# EAGLE design stm32f4_adapter (EAGLE 6.5.0)
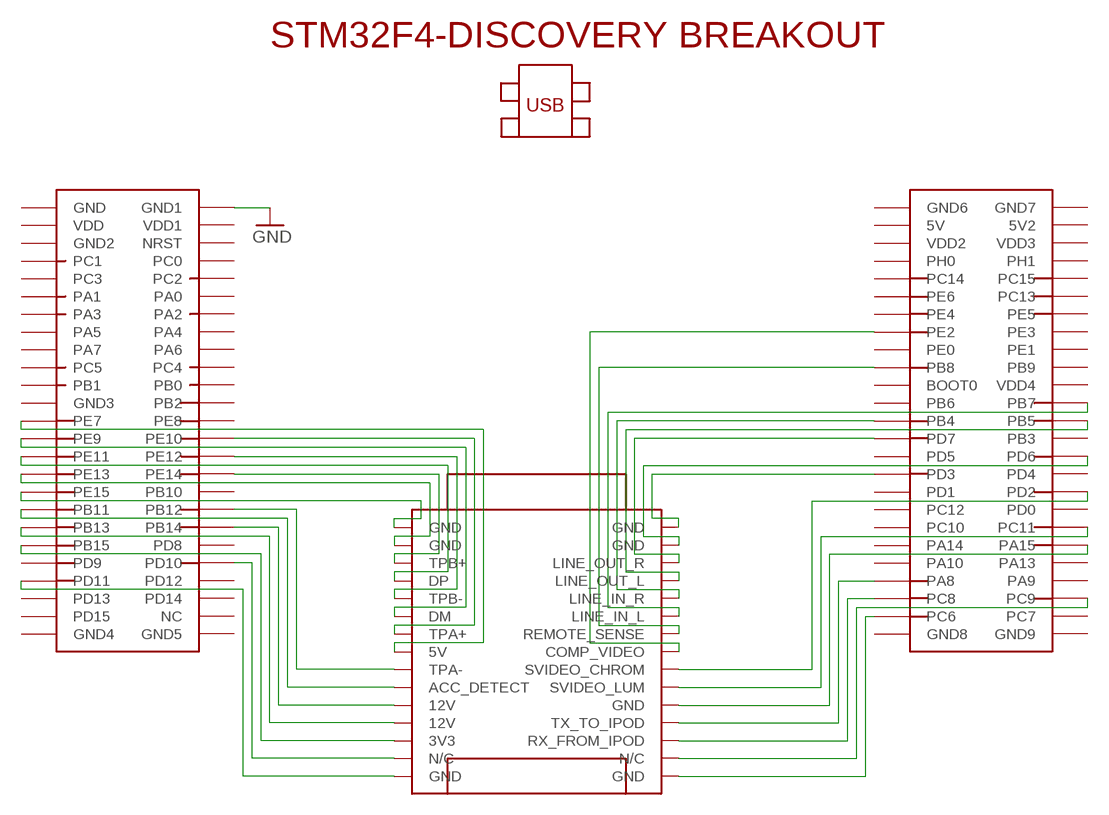
[diagram p0: schematic, sheet 1]

## Parts
U$1  STM32F4-DISCOVERY  [STM32F4-DISCOVERY]
U$2  IPOD-CONNECTOR  [IPOD-CONNECTOR]

## Nets
GND: U$1.P$2(GND1)
N$1: U$1.P$43(PD11) U$2.P$16(GND)
N$2: U$1.P$42(PD10) U$2.P$17(N/C)
N$3: U$1.P$39(PB15) U$2.P$18(3V3)
N$4: U$1.P$38(PB14) U$2.P$20(12V)
N$5: U$1.P$37(PB13) U$2.P$19(12V)
N$6: U$1.P$36(PB12) U$2.P$22(TPA-)
N$7: U$1.P$35(PB11) U$2.P$21(ACC_DETECT)
N$8: U$1.P$33(PE15) U$2.P$30(GND)
N$9: U$1.P$32(PE14) U$2.P$28(TPB+)
N$10: U$1.P$31(PE13) U$2.P$29(GND)
N$11: U$1.P$30(PE12) U$2.P$26(TPB-)
N$12: U$1.P$29(PE11) U$2.P$27(DP)
N$13: U$1.P$27(PE9) U$2.P$25(DM)
N$14: U$1.P$28(PE10) U$2.P$24(TPA+)
N$15: U$1.P$25(PE7) U$2.P$23(5V)
N$16: U$1.P$97(PC6) U$2.P$15(GND)
N$17: U$1.P$96(PC9) U$2.P$14(N/C)
N$18: U$1.P$95(PC8) U$2.P$13(RX_FROM_IPOD)
N$19: U$1.P$93(PA8) U$2.P$12(TX_TO_IPOD)
N$20: U$1.P$90(PA15) U$2.P$11(GND)
N$21: U$1.P$88(PC11) U$2.P$10(SVIDEO_LUM)
N$22: U$1.P$84(PD2) U$2.P$9(SVIDEO_CHROM)
N$23: U$1.P$65(PE2) U$2.P$8(COMP_VIDEO)
N$24: U$1.P$80(PD6) U$2.P$2(GND)
N$25: U$1.P$77(PD7) U$2.P$3(LINE_OUT_R)
N$26: U$1.P$76(PB5) U$2.P$4(LINE_OUT_L)
N$27: U$1.P$75(PB4) U$2.P$5(LINE_IN_R)
N$28: U$1.P$74(PB7) U$2.P$6(LINE_IN_L)
N$29: U$1.P$69(PB8) U$2.P$7(REMOTE_SENSE)
N$31: U$1.P$81(PD3) U$2.P$1(GND)
Unconnected: U$1.P$1(GND) U$1.P$3(VDD) U$1.P$4(VDD1) U$1.P$5(GND2) U$1.P$6(NRST) U$1.P$7(PC1) U$1.P$8(PC0) U$1.P$9(PC3) U$1.P$10(PC2) U$1.P$11(PA1) U$1.P$12(PA0) U$1.P$13(PA3) U$1.P$14(PA2) U$1.P$15(PA5) U$1.P$16(PA4) U$1.P$17(PA7) U$1.P$18(PA6) U$1.P$19(PC5) U$1.P$20(PC4) U$1.P$21(PB1) U$1.P$22(PB0) U$1.P$23(GND3) U$1.P$24(PB2) U$1.P$26(PE8) U$1.P$34(PB10) U$1.P$40(PD8) U$1.P$41(PD9) U$1.P$44(PD12) U$1.P$45(PD13) U$1.P$46(PD14) U$1.P$47(PD15) U$1.P$48(NC) U$1.P$49(GND4) U$1.P$50(GND5) U$1.P$51(GND6) U$1.P$52(GND7) U$1.P$53(5V) U$1.P$54(5V2) U$1.P$55(VDD2) U$1.P$56(VDD3) U$1.P$57(PH0) U$1.P$58(PH1) U$1.P$59(PC14) U$1.P$60(PC15) U$1.P$61(PE6) U$1.P$62(PC13) U$1.P$63(PE4) U$1.P$64(PE5) U$1.P$66(PE3) U$1.P$67(PE0) U$1.P$68(PE1) U$1.P$70(PB9) U$1.P$71(BOOT0) U$1.P$72(VDD4) U$1.P$73(PB6) U$1.P$78(PB3) U$1.P$79(PD5) U$1.P$82(PD4) U$1.P$83(PD1) U$1.P$85(PC12) U$1.P$86(PD0) U$1.P$87(PC10) U$1.P$89(PA14) U$1.P$91(PA10) U$1.P$92(PA13) U$1.P$94(PA9) U$1.P$98(PC7) U$1.P$99(GND8) U$1.P$100(GND9)

## Library data of the parts
U$1 = elva:STM32F4-DISCOVERY
U$2 = STM32F4-DISCOVERY:IPOD-CONNECTOR

## Board
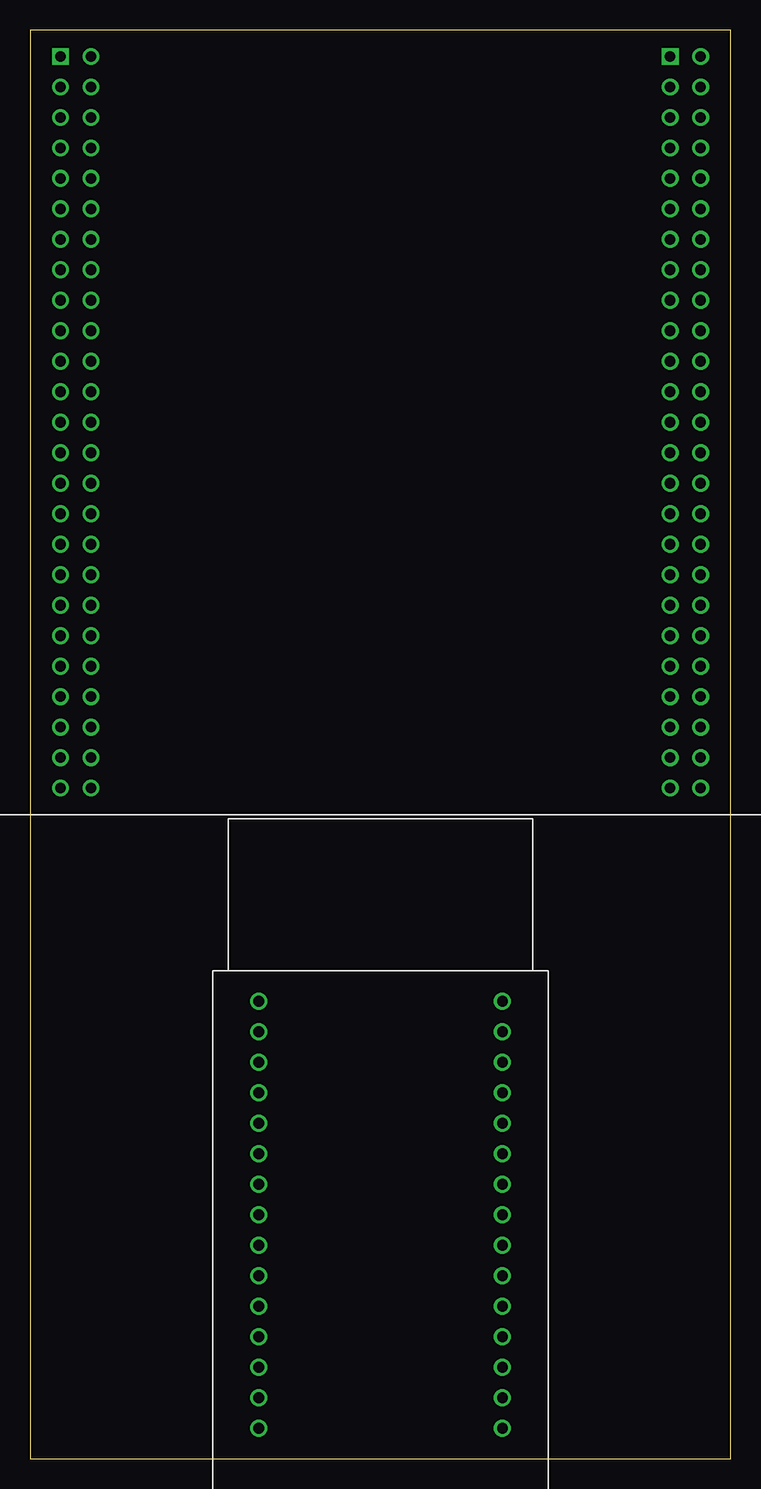
[diagram p1: board, top side]
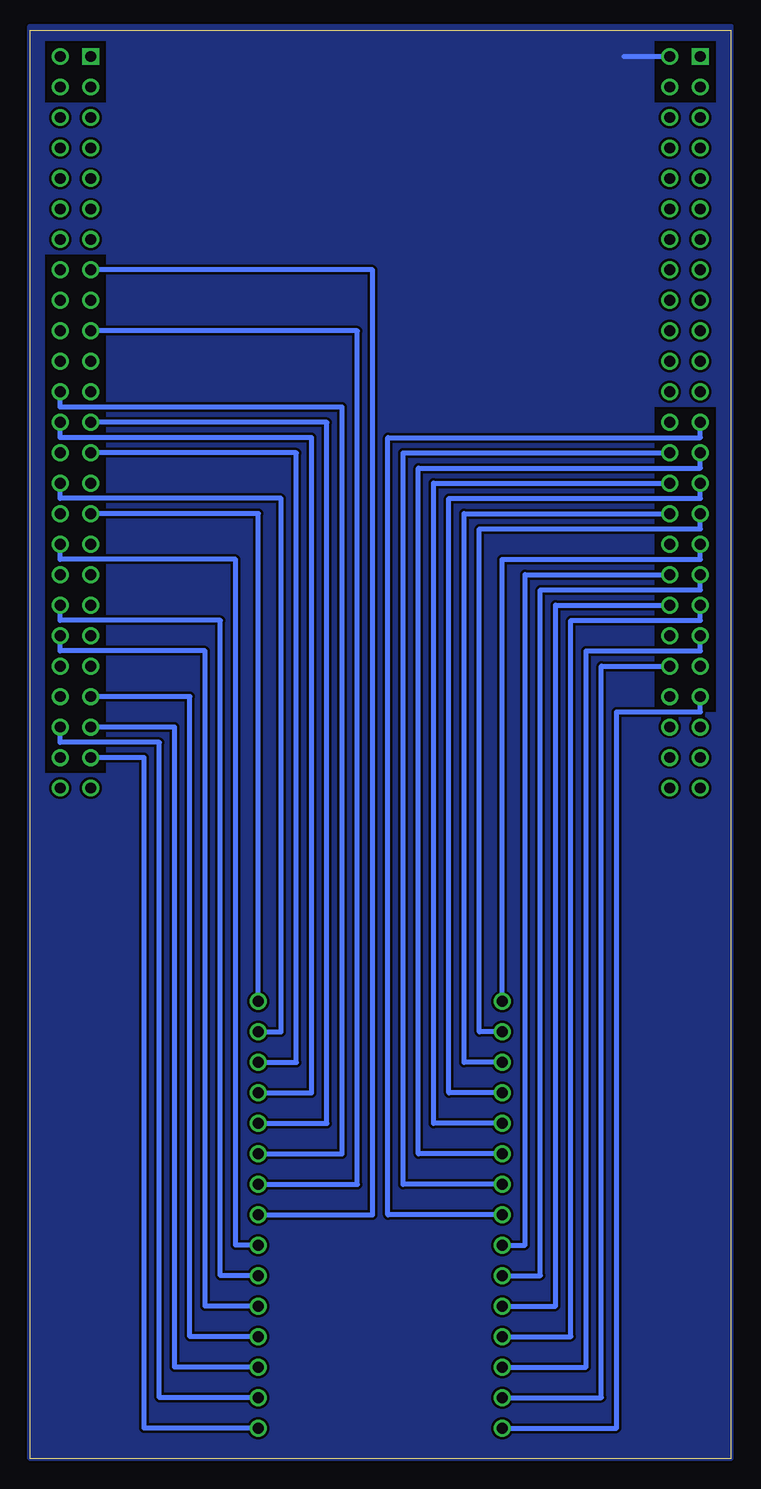
[diagram p2: board, bottom side, seen from below]

Size 58.4 x 119.05 mm. Coordinates in mm from the lower left corner, seen from the top.
Outline: 0,0 58.4,0 58.4,119.05 0,119.05 0,0
Copper layers (1*16): Top 0.035mm / dielectric 1.5mm / Bottom 0.035mm
Design rules "default *": minimum track width 10mil, minimum drill 24mil, track to track 8mil, track to pad 8mil, pad to pad 8mil, via to via 8mil, smd to smd 8mil, copper to edge 0mil, drill to drill 8mil, minimum pad ring 10mil, minimum via ring 8mil, stop-mask expansion 4mil, vias tented up to drill 0mil, thermal gap 10mil
bRestrict: area 1.3,62.2 to 6.3,87.6; area 52.1,57.1 to 57.1,100.3; area 71.1,1.3 to 73.7,39.4; area 63.5,1.3 to 66,39.4; area 1.3,113 to 6.3,118.1; area 52.1,113 to 57.1,118.1

### Footprints (pad centres in the part's own frame; a part is rotated, then mirrored left to right if it is on the bottom)
STM32F4-DISCOVERY = drill 0.9 square: P$1 -26.67,30.48; P$51 24.13,30.48 | drill 0.9: P$2 -24.13,30.48; P$3 -26.67,27.94; P$4 -24.13,27.94; P$5 -26.67,25.4; P$6 -24.13,25.4; P$7 -26.67,22.86; P$8 -24.13,22.86; P$9 -26.67,20.32; P$10 -24.13,20.32; P$11 -26.67,17.78; P$12 -24.13,17.78; P$13 -26.67,15.24; P$14 -24.13,15.24; P$15 -26.67,12.7; P$16 -24.13,12.7; P$17 -26.67,10.16; P$18 -24.13,10.16; P$19 -26.67,7.62; P$20 -24.13,7.62; P$21 -26.67,5.08; P$22 -24.13,5.08; P$23 -26.67,2.54; P$24 -24.13,2.54; P$25 -26.67,0; P$26 -24.13,0; P$27 -26.67,-2.54; P$28 -24.13,-2.54; P$29 -26.67,-5.08; P$30 -24.13,-5.08; P$31 -26.67,-7.62; P$32 -24.13,-7.62; P$33 -26.67,-10.16; P$34 -24.13,-10.16; P$35 -26.67,-12.7; P$36 -24.13,-12.7; P$37 -26.67,-15.24; P$38 -24.13,-15.24; P$39 -26.67,-17.78; P$40 -24.13,-17.78; P$41 -26.67,-20.32; P$42 -24.13,-20.32; P$43 -26.67,-22.86; P$44 -24.13,-22.86; P$45 -26.67,-25.4; P$46 -24.13,-25.4; P$47 -26.67,-27.94; P$48 -24.13,-27.94; P$49 -26.67,-30.48; P$50 -24.13,-30.48; P$52 26.67,30.48; P$53 24.13,27.94; P$54 26.67,27.94; P$55 24.13,25.4; P$56 26.67,25.4; P$57 24.13,22.86; P$58 26.67,22.86; P$59 24.13,20.32; P$60 26.67,20.32; P$61 24.13,17.78; P$62 26.67,17.78; P$63 24.13,15.24; P$64 26.67,15.24; P$65 24.13,12.7; P$66 26.67,12.7; P$67 24.13,10.16; P$68 26.67,10.16; P$69 24.13,7.62; P$70 26.67,7.62; P$71 24.13,5.08; P$72 26.67,5.08; P$73 24.13,2.54; P$74 26.67,2.54; P$75 24.13,0; P$76 26.67,0; P$77 24.13,-2.54; P$78 26.67,-2.54; P$79 24.13,-5.08; P$80 26.67,-5.08; P$81 24.13,-7.62; P$82 26.67,-7.62; P$83 24.13,-10.16; P$84 26.67,-10.16; P$85 24.13,-12.7; P$86 26.67,-12.7; P$87 24.13,-15.24; P$88 26.67,-15.24; P$89 24.13,-17.78; P$90 26.67,-17.78; P$91 24.13,-20.32; P$92 26.67,-20.32; P$93 24.13,-22.86; P$94 26.67,-22.86; P$95 24.13,-25.4; P$96 26.67,-25.4; P$97 24.13,-27.94; P$98 26.67,-27.94; P$99 24.13,-30.48; P$100 26.67,-30.48
IPOD-CONNECTOR = drill 0.9: P$1 10.16,17.78; P$2 10.16,15.24; P$3 10.16,12.7; P$4 10.16,10.16; P$5 10.16,7.62; P$6 10.16,5.08; P$7 10.16,2.54; P$8 10.16,0; P$9 10.16,-2.54; P$10 10.16,-5.08; P$11 10.16,-7.62; P$12 10.16,-10.16; P$13 10.16,-12.7; P$14 10.16,-15.24; P$15 10.16,-17.78; P$16 -10.16,-17.78; P$17 -10.16,-15.24; P$18 -10.16,-12.7; P$19 -10.16,-10.16; P$20 -10.16,-7.62; P$21 -10.16,-5.08; P$22 -10.16,-2.54; P$23 -10.16,0; P$24 -10.16,2.54; P$25 -10.16,5.08; P$26 -10.16,7.62; P$27 -10.16,10.16; P$28 -10.16,12.7; P$29 -10.16,15.24; P$30 -10.16,17.78

### Placement (x,y rotation side)
U$1  29.21,86.36 0 top
U$2  29.21,20.32 0 top

### Tracks (layer width: path | path; a pad name or v marks a point on that pad's centre or on a via)
GND
  Bottom 0.406: U$1.P$2 8.89,116.84
  pour Bottom: 0,0 58.42,0 58.42,119.38 0,119.38
N$1
  Bottom 0.406: U$2.P$16 9.53,2.54 9.53,62.23 2.54,62.23 U$1.P$43
N$2
  Bottom 0.406: U$2.P$17 10.79,5.08 10.79,66.04 U$1.P$42
N$3
  Bottom 0.406: U$2.P$18 12.06,7.62 12.06,67.31 2.54,67.31 U$1.P$39
N$4
  Bottom 0.406: U$2.P$20 14.61,12.7 14.61,71.12 U$1.P$38
N$5
  Bottom 0.406: U$2.P$19 13.34,10.16 13.34,69.85 2.54,69.85 U$1.P$37
N$6
  Bottom 0.406: U$2.P$22 17.14,17.78 17.14,73.66 U$1.P$36
N$7
  Bottom 0.406: U$2.P$21 15.88,15.24 15.88,72.39 2.54,72.39 U$1.P$35
N$8
  Bottom 0.406: U$2.P$30 19.05,74.93 2.54,74.93 U$1.P$33
N$9
  Bottom 0.406: U$2.P$28 22.23,33.02 22.23,78.74 U$1.P$32
N$10
  Bottom 0.406: U$2.P$29 20.95,35.56 20.95,77.47 2.54,77.47 U$1.P$31
N$11
  Bottom 0.406: U$2.P$26 24.77,27.94 24.77,81.28 U$1.P$30
N$12
  Bottom 0.406: U$2.P$27 23.5,30.48 23.5,80.01 2.54,80.01 U$1.P$29
N$13
  Bottom 0.406: U$2.P$25 26.04,25.4 26.04,82.55 2.54,82.55 U$1.P$27
N$14
  Bottom 0.406: U$2.P$24 27.3,22.86 27.3,83.82 U$1.P$28
N$15
  Bottom 0.406: U$2.P$23 28.57,20.32 28.57,85.09 2.54,85.09 U$1.P$25
N$16
  Bottom 0.406: U$2.P$15 48.9,2.54 48.9,58.42 U$1.P$97
N$17
  Bottom 0.406: U$2.P$14 47.62,5.08 47.62,59.69 55.88,59.69 U$1.P$96
N$18
  Bottom 0.406: U$2.P$13 46.35,7.62 46.35,60.96 U$1.P$95
N$19
  Bottom 0.406: U$2.P$12 45.09,10.16 45.09,63.5 U$1.P$93
N$20
  Bottom 0.406: U$2.P$11 43.81,12.7 43.81,67.31 55.88,67.31 U$1.P$90
N$21
  Bottom 0.406: U$2.P$10 42.55,15.24 42.55,69.85 55.88,69.85 U$1.P$88
N$22
  Bottom 0.406: U$2.P$9 41.27,17.78 41.27,74.93 55.88,74.93 U$1.P$84
N$23
  Bottom 0.406: U$2.P$8 29.84,20.32 29.84,99.06 U$1.P$65
N$24
  Bottom 0.406: U$2.P$2 37.47,35.56 37.47,80.01 55.88,80.01 U$1.P$80
N$25
  Bottom 0.406: U$2.P$3 36.2,33.02 36.2,83.82 U$1.P$77
N$26
  Bottom 0.406: U$2.P$4 34.92,30.48 34.92,85.09 55.88,85.09 U$1.P$76
N$27
  Bottom 0.406: U$2.P$5 33.66,27.94 33.66,86.36 U$1.P$75
N$28
  Bottom 0.406: U$2.P$6 32.38,25.4 32.38,87.63 55.88,87.63 U$1.P$74
N$29
  Bottom 0.406: U$2.P$7 31.11,22.86 31.11,93.98 U$1.P$69
N$31
  Bottom 0.406: U$2.P$1 39.37,78.74 U$1.P$81